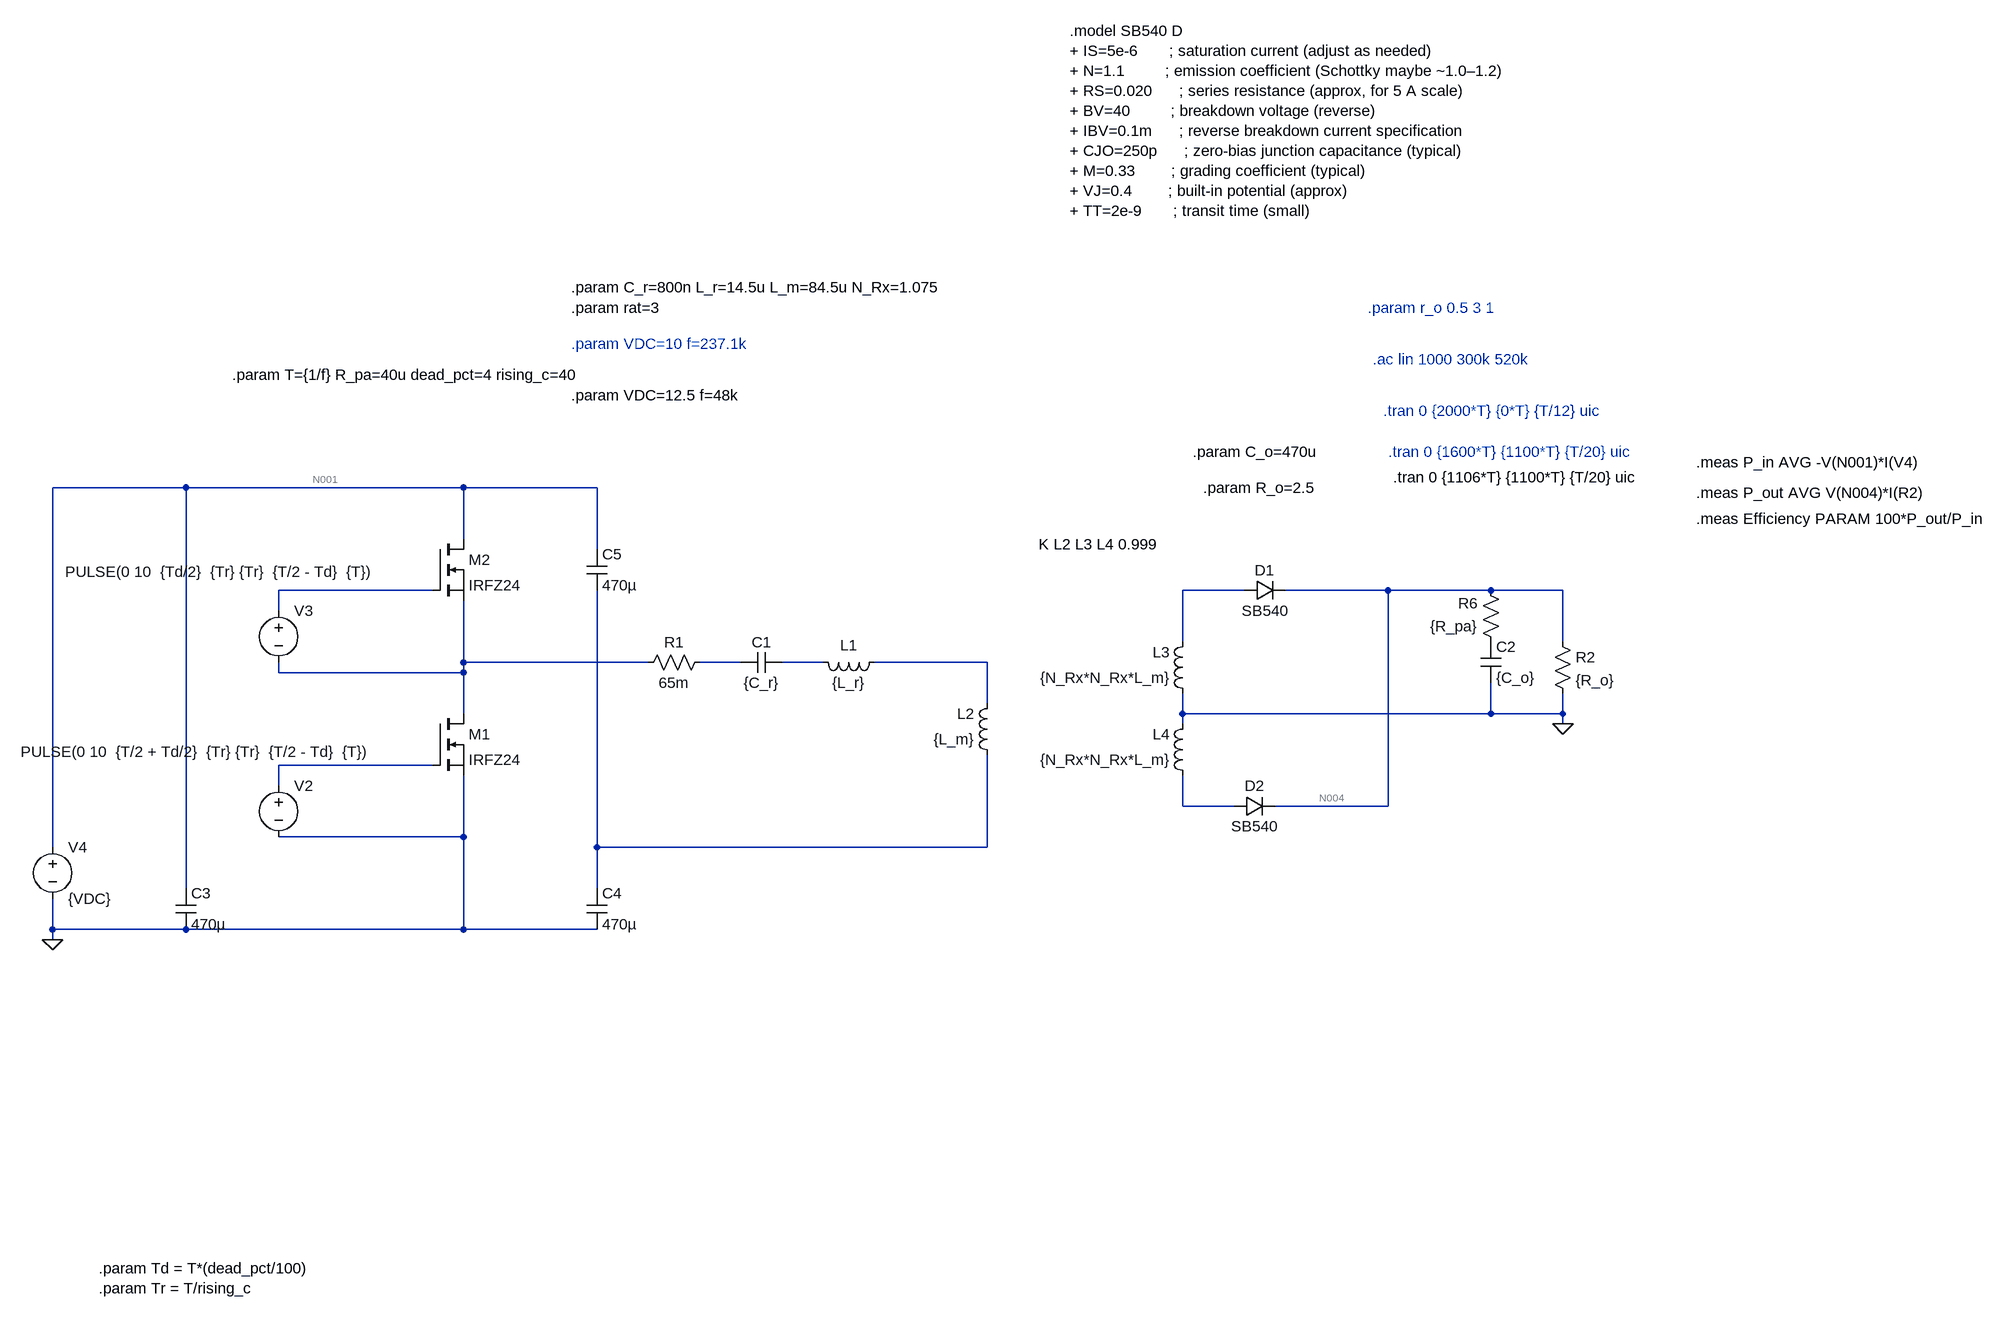
[diagram p0: schematic LLC.asc]
LLC.asc, the LTspice schematic file:
Version 4.1
SHEET 1 2536 880
WIRE -304 -448 -512 -448
WIRE 128 -448 -304 -448
WIRE 336 -448 128 -448
WIRE 128 -368 128 -448
WIRE 336 -352 336 -448
WIRE 80 -288 -160 -288
WIRE 1344 -288 1248 -288
WIRE 1568 -288 1408 -288
WIRE 1728 -288 1568 -288
WIRE 1840 -288 1728 -288
WIRE -160 -256 -160 -288
WIRE 1248 -208 1248 -288
WIRE 1840 -208 1840 -288
WIRE 128 -176 128 -272
WIRE 416 -176 128 -176
WIRE 560 -176 496 -176
WIRE 688 -176 624 -176
WIRE 944 -176 768 -176
WIRE -160 -160 -160 -176
WIRE 128 -160 128 -176
WIRE 128 -160 -160 -160
WIRE 944 -112 944 -176
WIRE 128 -96 128 -160
WIRE 1248 -96 1248 -128
WIRE 1728 -96 1728 -144
WIRE 1728 -96 1248 -96
WIRE 1840 -96 1840 -128
WIRE 1840 -96 1728 -96
WIRE 1248 -80 1248 -96
WIRE 1840 -80 1840 -96
WIRE 80 -16 -160 -16
WIRE -160 16 -160 -16
WIRE 1248 48 1248 0
WIRE 1328 48 1248 48
WIRE 1568 48 1568 -288
WIRE 1568 48 1392 48
WIRE 128 96 128 0
WIRE 128 96 -160 96
WIRE -512 112 -512 -448
WIRE 336 112 336 -288
WIRE 944 112 944 -32
WIRE 944 112 336 112
WIRE -304 176 -304 -448
WIRE 336 176 336 112
WIRE -512 240 -512 192
WIRE -304 240 -512 240
WIRE 128 240 128 96
WIRE 128 240 -304 240
WIRE 336 240 128 240
WIRE -512 256 -512 240
FLAG 1840 -80 0
FLAG -512 256 0
SYMBOL voltage -160 -272 R0
WINDOW 3 -332 -45 Left 2
WINDOW 123 0 0 Left 0
WINDOW 39 0 0 Left 0
SYMATTR Value PULSE(0 10  {Td/2}  {Tr} {Tr}  {T/2 - Td}  {T})
SYMATTR InstName V3
SYMBOL voltage -160 0 R0
WINDOW 3 -402 -37 Left 2
WINDOW 123 0 0 Left 0
WINDOW 39 0 0 Left 0
SYMATTR Value PULSE(0 10  {T/2 + Td/2}  {Tr} {Tr}  {T/2 - Td}  {T})
SYMATTR InstName V2
SYMBOL cap 624 -192 R90
WINDOW 0 0 32 VBottom 2
WINDOW 3 32 32 VTop 2
SYMATTR InstName C1
SYMATTR Value {C_r}
SYMBOL ind 784 -192 R90
WINDOW 0 5 56 VBottom 2
WINDOW 3 32 56 VTop 2
SYMATTR InstName L1
SYMATTR Value {L_r}
SYMBOL ind 960 -16 R180
WINDOW 0 36 80 Left 2
WINDOW 3 36 40 Left 2
SYMATTR InstName L2
SYMATTR Value {L_m}
SYMATTR Type ind
SYMBOL ind 1264 -112 R180
WINDOW 0 36 80 Left 2
WINDOW 3 36 40 Left 2
SYMATTR InstName L3
SYMATTR Value {N_Rx*N_Rx*L_m}
SYMATTR Type ind
SYMBOL ind 1264 16 R180
WINDOW 0 36 80 Left 2
WINDOW 3 36 40 Left 2
SYMATTR InstName L4
SYMATTR Value {N_Rx*N_Rx*L_m}
SYMATTR Type ind
SYMBOL res 1824 -224 R0
SYMATTR InstName R2
SYMATTR Value {R_o}
SYMBOL res 1744 -192 R180
WINDOW 0 36 76 Left 2
WINDOW 3 36 40 Left 2
SYMATTR InstName R6
SYMATTR Value {R_pa}
SYMBOL voltage -512 96 R0
WINDOW 123 0 0 Left 0
WINDOW 39 0 0 Left 0
SYMATTR InstName V4
SYMATTR Value {VDC}
SYMBOL nmos 80 -368 R0
SYMATTR InstName M2
SYMATTR Value IRFZ24
SYMBOL cap 1712 -208 R0
SYMATTR InstName C2
SYMATTR Value {C_o}
SYMBOL diode 1344 -272 R270
WINDOW 0 32 32 VTop 2
WINDOW 3 0 32 VBottom 2
SYMATTR InstName D1
SYMATTR Value SB540
SYMBOL diode 1328 64 R270
WINDOW 0 32 32 VTop 2
WINDOW 3 0 32 VBottom 2
SYMATTR InstName D2
SYMATTR Value SB540
SYMBOL nmos 80 -96 R0
SYMATTR InstName M1
SYMATTR Value IRFZ24
SYMBOL cap -320 176 R0
SYMATTR InstName C3
SYMATTR Value 470µ
SYMBOL cap 320 176 R0
SYMATTR InstName C4
SYMATTR Value 470µ
SYMBOL cap 320 -352 R0
SYMATTR InstName C5
SYMATTR Value 470µ
SYMBOL res 512 -192 R90
WINDOW 0 0 56 VBottom 2
WINDOW 3 32 56 VTop 2
SYMATTR InstName R1
SYMATTR Value 65m
TEXT -232 -624 Left 2 !.param T={1/f} R_pa=40u dead_pct=4 rising_c=40
TEXT 296 -760 Left 2 !.param C_r=800n L_r=14.5u L_m=84.5u N_Rx=1.075
TEXT 1264 -504 Left 2 !.param C_o=470u
TEXT 1024 -360 Left 2 !K L2 L3 L4 0.999
TEXT 1536 -728 Left 2 ;.param r_o 0.5 3 1
TEXT 1544 -648 Left 2 ;.ac lin 1000 300k 520k
TEXT 1280 -448 Left 2 !.param R_o=2.5
TEXT 1560 -568 Left 2 ;.tran 0 {2000*T} {0*T} {T/12} uic
TEXT 1072 -1160 Left 2 !.model SB540 D  \n+ IS=5e-6       ; saturation current (adjust as needed)  \n+ N=1.1         ; emission coefficient (Schottky maybe ~1.0–1.2)  \n+ RS=0.020      ; series resistance (approx, for 5 A scale)  \n+ BV=40         ; breakdown voltage (reverse)  \n+ IBV=0.1m      ; reverse breakdown current specification  \n+ CJO=250p      ; zero-bias junction capacitance (typical)  \n+ M=0.33        ; grading coefficient (typical)  \n+ VJ=0.4        ; built-in potential (approx)  \n+ TT=2e-9       ; transit time (small)
TEXT 2048 -488 Left 2 !.meas P_in AVG -V(N001)*I(V4)
TEXT 2048 -440 Left 2 !.meas P_out AVG V(N004)*I(R2)
TEXT 2048 -400 Left 2 !.meas Efficiency PARAM 100*P_out/P_in
TEXT -440 768 Left 2 !.param Td = T*(dead_pct/100)\n.param Tr = T/rising_c
TEXT 296 -672 Left 2 ;.param VDC=10 f=237.1k
TEXT 1568 -504 Left 2 ;.tran 0 {1600*T} {1100*T} {T/20} uic
TEXT 296 -728 Left 2 !.param rat=3
TEXT 296 -592 Left 2 !.param VDC=12.5 f=48k
TEXT 1576 -464 Left 2 !.tran 0 {1106*T} {1100*T} {T/20} uic

The netlist it stands for:
* LLC.asc
V3 N002 N005 PULSE(0 10  {Td/2}  {Tr} {Tr}  {T/2 - Td}  {T})
V2 N009 0 PULSE(0 10  {T/2 + Td/2}  {Tr} {Tr}  {T/2 - Td}  {T})
C1 N007 N006 {C_r}
L1 N008 N007 {L_r}
L2 N011 N008 {L_m}
L3 0 N003 {N_Rx*N_Rx*L_m}
L4 N010 0 {N_Rx*N_Rx*L_m}
R2 N004 0 {R_o}
R6 P001 N004 {R_pa}
V4 N001 0 {VDC}
M2 N001 N002 N005 N005 IRFZ24
C2 P001 0 {C_o}
D1 N003 N004 SB540
D2 N010 N004 SB540
M1 N005 N009 0 0 IRFZ24
C3 N001 0 470µ
C4 N011 0 470µ
C5 N001 N011 470µ
R1 N006 N005 65m
.model D D
.lib standard.dio
.model NMOS NMOS
.model PMOS PMOS
.lib standard.mos
.param T={1/f} R_pa=40u dead_pct=4 rising_c=40
.param C_r=800n L_r=14.5u L_m=84.5u N_Rx=1.075
.param C_o=470u
K L2 L3 L4 0.999
* .param r_o 0.5 3 1
* .ac lin 1000 300k 520k
.param R_o=2.5
* .tran 0 {2000*T} {0*T} {T/12} uic
.model SB540 D
+ IS=5e-6       ; saturation current (adjust as needed)
+ N=1.1         ; emission coefficient (Schottky maybe ~1.0–1.2)
+ RS=0.020      ; series resistance (approx, for 5 A scale)
+ BV=40         ; breakdown voltage (reverse)
+ IBV=0.1m      ; reverse breakdown current specification
+ CJO=250p      ; zero-bias junction capacitance (typical)
+ M=0.33        ; grading coefficient (typical)
+ VJ=0.4        ; built-in potential (approx)
+ TT=2e-9       ; transit time (small)
.meas P_in AVG -V(N001)*I(V4)
.meas P_out AVG V(N004)*I(R2)
.meas Efficiency PARAM 100*P_out/P_in
.param Td = T*(dead_pct/100)
.param Tr = T/rising_c
* .param VDC=10 f=237.1k
* .tran 0 {1600*T} {1100*T} {T/20} uic
.param rat=3
.param VDC=12.5 f=48k
.tran 0 {1106*T} {1100*T} {T/20} uic
.backanno
.end